# EAGLE design Single-Phase-Energy-Meter_v1.3-rev2 (EAGLE 9.3.0)
CNAME: Single Phase Energy Meter; CREVISION: 2; DESIGNER: John deGlavina
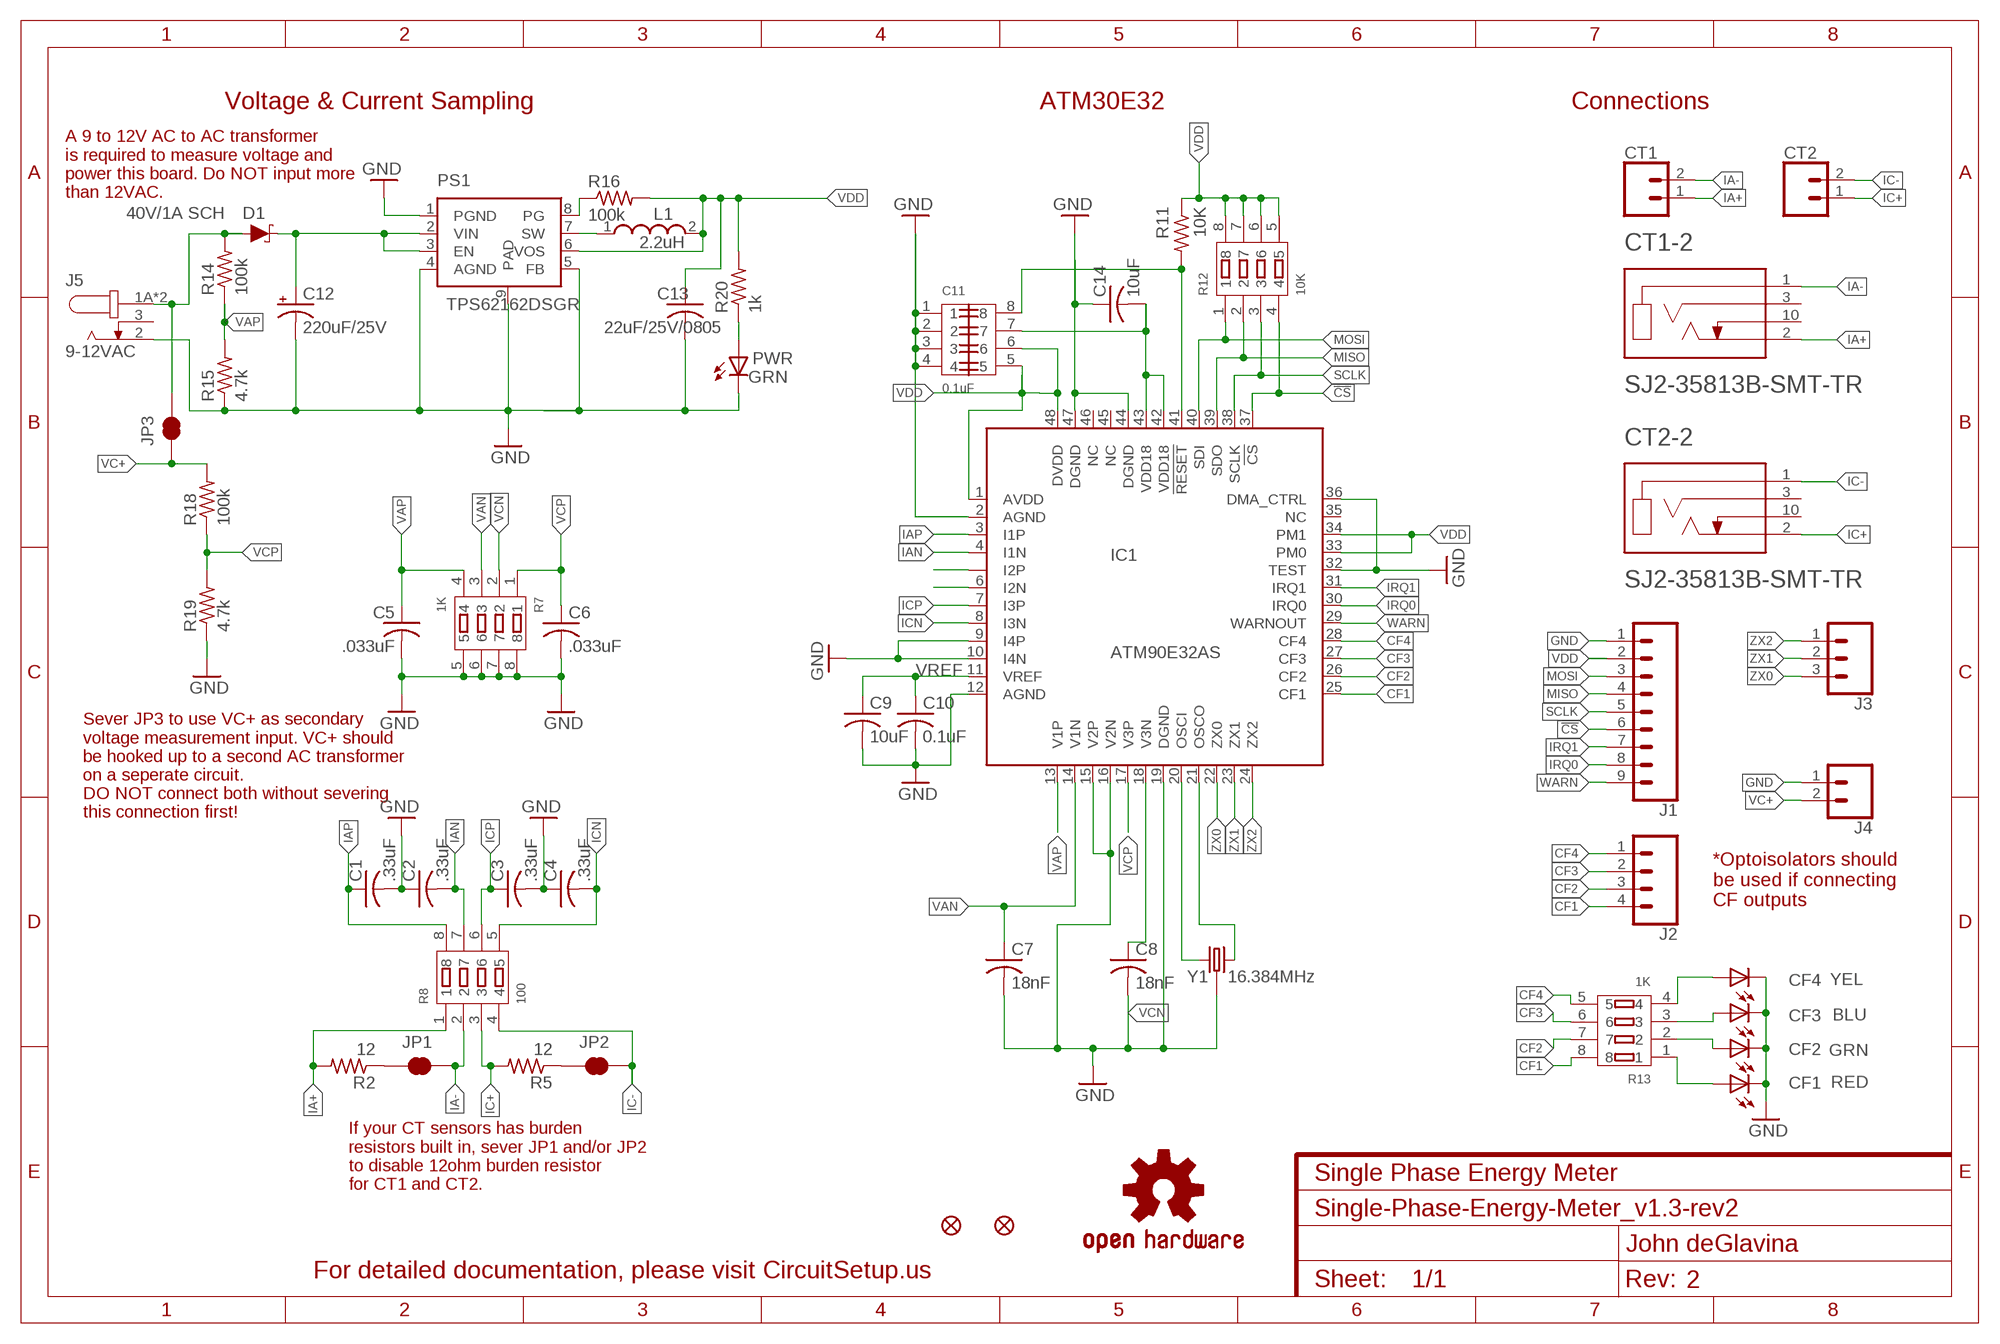
[diagram p0: schematic, sheet 1]

## Parts
C1  .33uF  C-USC0603  [C0603]
C2  .33uF  C-USC0603  [C0603]
C3  .33uF  C-USC0603  [C0603]
C4  .33uF  C-USC0603  [C0603]
C5  .033uF  C-USC0603  [C0603]
C6  .033uF  C-USC0603  [C0603]
C7  18nF  C-USC0603  [C0603]
C8  18nF  C-USC0603  [C0603]
C9  10uF  C-USC0603  [C0603]
C10  0.1uF  C-USC0603  [C0603]
C11  0.1uF  CAP-ARRAY4  [CAPCAF80P320X160X70-8]
C12  220uF/25V  CPOL-US153CLV-0605  [153CLV-0605]
C13  22uF/25V/0805  C-USC0805  [C0805]
C14  10uF  C-USC0603  [C0603]
CF1  RED  LEDCHIP-LED0603  [CHIP-LED0603]
CF2  GRN  LEDCHIP-LED0603  [CHIP-LED0603]
CF3  BLU  LEDCHIP-LED0603  [CHIP-LED0603]
CF4  YEL  LEDCHIP-LED0603  [CHIP-LED0603]
CT1  CONN_023.5MM  [SCREWTERMINAL-3.5MM-2]
CT1-2  SJ2-35813B-SMT-TR  [CUI_SJ2-35813B-SMT-TR]
CT2  CONN_023.5MM  [SCREWTERMINAL-3.5MM-2]
CT2-2  SJ2-35813B-SMT-TR  [CUI_SJ2-35813B-SMT-TR]
D1  40V/1A SCH  DIODE-SCHOTTKY-SS14  [SMA-DIODE]
FD1  FIDUCIALUFIDUCIAL  [FIDUCIAL-MICRO]
FD2  FIDUCIALUFIDUCIAL  [FIDUCIAL-MICRO]
IC1  ATM90E32AS  ATM90E36  [QFP50P900X900X120-48N]
J1  CONN_09  [1X09]
J2  CONN_04  [1X04]
J3  CONN_03  [1X03]
J4  CONN_02  [1X02]
J5  9-12VAC  PJ-002AH-SMT-TR  [CUI_PJ-002AH-SMT-TR]
JP1  JUMPER-SMT_2_NC_TRACE_SILK  [SMT-JUMPER_2_NC_TRACE_SILK]
JP2  JUMPER-SMT_2_NC_TRACE_SILK  [SMT-JUMPER_2_NC_TRACE_SILK]
JP3  JUMPER-SMT_2_NC_TRACE_SILK  [SMT-JUMPER_2_NC_TRACE_SILK]
L1  2.2uH  PA4332.222NLT  [INDPM4042X200N]
LOGO1  OSHW-LOGOS  [OSHW-LOGO-S]
PS1  TPS62162DSGR  [SON50P200X200X80-9N]
PWR  GRN  LEDCHIP-LED0603  [CHIP-LED0603]
R2  12  R-US_R0603  [R0603]
R5  12  R-US_R0603  [R0603]
R7  1K  SMD-RES-ARRAY-1K-4R(RA1206-8)  [RA1206-8]
R8  100  SMD-RES-ARRAY-1K-4R(RA1206-8)  [RA1206-8]
R11  10K  R-US_R0603  [R0603]
R12  10K  SMD-RES-ARRAY-1K-4R(RA1206-8)  [RA1206-8]
R13  1K  SMD-RES-ARRAY-1K-4R(RA1206-8)  [RA1206-8]
R14  100k  R-US_R0603  [R0603]
R15  4.7k  R-US_R0603  [R0603]
R16  100k  R-US_R0603  [R0603]
R18  100k  R-US_R0603  [R0603]
R19  4.7k  R-US_R0603  [R0603]
R20  1k  R-US_R0603  [R0603]
Y1  16.384MHz  CRYSTAL-GROUNDEDSMD-3.2X2.5  [CRYSTAL-SMD-3.2X2.5MM]

## Nets
!CS: IC1.37(!CS) J1.6 R12.4
!RESET: C11.8 IC1.41(!RESET) R11.2
CF1: IC1.25(CF1) J2.4 R13.8
CF2: IC1.26(CF2) J2.3 R13.7
CF3: IC1.27(CF3) J2.2 R13.6
CF4: IC1.28(CF4) J2.1 R13.5
GND: C1.2 C2.1 C3.2 C4.1 C5.2 C6.2 C7.2 C8.2 C9.2 C10.2 C11.1 C11.2 C11.3 C11.4 C12.- C13.2 C14.1 CF1.C CF2.C CF3.C CF4.C IC1.2(AGND) IC1.9(I4P) IC1.10(I4N) IC1.12(AGND) IC1.15(V2P) IC1.16(V2N) IC1.19(DGND) IC1.32(TEST) IC1.36(DMA_CTRL) IC1.44(DGND) IC1.47(DGND) J1.1 J4.1 J5.2 PS1.1(PGND) PS1.4(AGND) PS1.5(FB) PS1.9(PAD) PWR.C R7.5 R7.6 R7.7 R7.8 R15.1 R19.1 Y1.2 Y1.4
IA+ [analog]: CT1-2.2(TIP) CT1.1 R2.2 R8.1
IA- [analog]: CT1-2.1(SLEEVE) CT1.2 JP1.2 R8.2
IAN [analog]: C2.2 IC1.4(I1N) R8.7
IAP [analog]: C1.1 IC1.3(I1P) R8.8
IC+ [analog]: CT2-2.2(TIP) CT2.1 R5.2 R8.3
IC- [analog]: CT2-2.1(SLEEVE) CT2.2 JP2.2 R8.4
ICN [analog]: C4.2 IC1.8(I3N) R8.5
ICP [analog]: C3.1 IC1.7(I3P) R8.6
IRQ0: IC1.30(IRQ0) J1.8
IRQ1: IC1.31(IRQ1) J1.7
MISO: IC1.39(SDO) J1.4 R12.2
MOSI: IC1.40(SDI) J1.3 R12.1
N$1: JP1.1 R2.1
N$2: JP2.1 R5.1
N$3: CF4.A R13.4
N$4: CF3.A R13.3
N$5: CF2.A R13.2
N$6: CF1.A R13.1
N$7: L1.1 PS1.7(SW)
N$8: IC1.5(I2P)
N$9: PS1.8(PG) R16.1
N$10: IC1.6(I2N)
N$12: PWR.A R20.1
OSCI: IC1.20(OSCI) Y1.1
OSCO: IC1.21(OSCO) Y1.3
SCLK: IC1.38(SCLK) J1.5 R12.3
VA+: D1.A J5.1A J5.1B JP3.2 R14.2
VAN [analog]: C7.1 IC1.14(V1N) R7.3
VAP [analog]: C5.1 IC1.13(V1P) R7.4 R14.1 R15.2
VC+: J4.2 JP3.1 R18.2
VCN [analog]: C8.1 IC1.18(V3N) R7.2
VCP [analog]: C6.1 IC1.17(V3P) R7.1 R18.1 R19.2
VDD [pwr]: C11.5 C11.6 C13.1 IC1.1(AVDD) IC1.33(PM0) IC1.34(PM1) IC1.48(DVDD) J1.2 L1.2 PS1.6(VOS) R11.1 R12.5 R12.6 R12.7 R12.8 R16.2 R20.2
VDD18 [pwr]: C11.7 C14.2 IC1.42(VDD18) IC1.43(VDD18)
VIN1: C12.+ D1.C PS1.2(VIN) PS1.3(EN)
VREF: C9.1 C10.1 IC1.11(VREF)
WARN: IC1.29(WARNOUT) J1.9
ZX0: IC1.22(ZX0) J3.3
ZX1: IC1.23(ZX1) J3.2
ZX2: IC1.24(ZX2) J3.1
Unconnected: CT1-2.3(RING) CT1-2.10(TIP_SWITCH) CT2-2.3(RING) CT2-2.10(TIP_SWITCH) IC1.35(NC) IC1.45(NC) IC1.46(NC) J5.3

## Notes on the sheet
- Voltage & Current Sampling | ATM30E32 | Connections
- A 9 to 12V AC to AC transformer
  is required to measure voltage and 
  power this board. Do NOT input more 
  than 12VAC.
- Sever JP3 to use VC+ as secondary 
  voltage measurement input. VC+ should
  be hooked up to a second AC transformer
  on a seperate circuit.
  DO NOT connect both without severing 
  this connection first!
- *Optoisolators should 
  be used if connecting 
  CF outputs
- If your CT sensors has burden 
  resistors built in, sever JP1 and/or JP2
  to disable 12ohm burden resistor 
  for CT1 and CT2.
- For detailed documentation, please visit CircuitSetup.us

## Library data of the parts
C1-C10 C13 C14 = rcl:C-US: CAPACITOR, American symbol; SPICEPREFIX: C
C11 = CL31B104KACNBNC:CAP-ARRAY4
C12 = rcl:CPOL-US: POLARIZED CAPACITOR, American symbol; SPICEPREFIX: C
CF1-CF4 PWR = adafruit:LED: LED OSRAM: - CHIPLED LG R971, LG N971, LY N971, LG Q971, LY Q971, LO R971, LY R971 LH N974, LH R974 LS Q976, LO Q976, LY Q976 LO Q996 - Hyper CHIPLED LW Q18S LB Q993, LB Q99A, LB R99A - SideLED LS A670, LO A670, LY A670, LG A670, LP A670 LB A673, LV A673, LT A673, LW A673 LH A674 LY A675 LS A676, LA A676, LO A676, LY A676, LW A676 LS A679, LY A679, LG A679 - Hyper Micro SIDELED® LS Y876, LA Y876, LO Y876, LY Y876 LT Y87S - SmartLED LW L88C, LW L88S LB L89C, LB L89S, LG L890 LS L89K, LO L89K, LY L89K LS L896, LA L896, LO L896, LY L896 - TOPLED LS T670, LO T670, LY T670, LG T670, LP T670 LSG T670, LSP T670, LSY T670, LOP T670, LYG T670 LG T671, LOG T671, LSG T671 LB T673, LV T673, LT T673, LW T673 LH T674 LS T676, LA T676, LO T676, LY T676, LB T676, LH T676, LSB T676, LW T676 LB T67C, LV T67C, LT T67C, LS T67K, LO T67K, LY T67K, LW E67C LS E67B, LA E67B, LO E67B, LY E67B, LB E67C, LV E67C, LT E67C LW T67C LS T679, LY T679, LG T679 LS T770, LO T770, LY T770, LG T770, LP T770 LB T773, LV T773, LT T773, LW T773 LH T774 LS E675, LA E675, LY E675, LS T675 LS T776, LA T776, LO T776, LY T776, LB T776 LHGB T686 LT T68C, LB T68C - Hyper Mini TOPLED® LB M676 - Mini TOPLED Santana® LG M470 LS M47K, LO M47K, LY M47K Source: http://www.osram.convergy.de/
CT1 CT2 = SparkFun-Connectors:CONN_02: Multi connection point. Often used as Generic Header-pin footprint for 0.1 inch spaced/style header connections On any of the 0.1 inch spaced packages, you can populate with these: Break Away Headers - Straight <https://www.sparkfun.com/products/116> (PRT-00116) Break Away Male Headers - Right Angle <https://www.sparkfun.com/products/553> (PRT-00553) Female Headers <https://www.sparkfun.com/products/115> (PRT-00115) Break Away Headers - Machine Pin <https://www.sparkfun.com/products/117> (PRT-00117) Break Away Female Headers - Swiss Machine Pin <https://www.sparkfun.com/products/743> (PRT-00743) For SCREWTERMINALS and SPRING TERMINALS visit here: Screw Terimnals on SparkFun.com <https://www.sparkfun.com/search/results?term=Screw+Terminals> (5mm/3.5mm/2.54mm spacing) This device is also useful as a general connection point to wire up your design to another part of your project. Our various solder wires solder well into these plated through hole pads. Hook-Up Wire - Assortment (Stranded, 22 AWG) <https://www.sparkfun.com/products/11375> (PRT-11375) Hook-Up Wire - Assortment (Solid Core, 22 AWG) <https://www.sparkfun.com/products/11367> (PRT-11367) View the entire wire category on our website here <https://www.sparkfun.com/categories/141> Special notes: Molex polarized connector foot print use with: PRT-08233 with associated crimp pins and housings. 2.54_SCREWTERM for use with PRT-10571. 3.5mm Screw Terminal footprints for PRT-08084 5mm Screw Terminal footprints for use with PRT-08432; PROD_ID: CONN-08399
CT1-2 CT2-2 = SJ2-35813B-SMT-TR:SJ2-35813B-SMT-TR: 3 conductors, 3.5mm, SMT Audio Jack w/ Tip Switch; MANUFACTURER: CUI; MPN: SJ2-35813B-SMT-TR; PART_REV: 1.01; STANDARD: Manufacturer recommendation
D1 = SparkFun-DiscreteSemi:DIODE-SCHOTTKY: Schottky diode A Schottky diode is a semiconductor diode which has a low forward voltage drop and a very fast switching action.; PROD_ID: DIO-08053; VALUE: 1A/40V/500mV
FD1 FD2 = SparkFun-Aesthetics:FIDUCIAL: Fiducial Alignment Points Point-of-reference for pick-and-place machines and other optical instruments.
IC1 = ATM90E36:ATM90E36: ATMEL Poly-phase energy metering; OC_FARNELL: unknown; OC_NEWARK: unknown; SPICEPREFIX: X
J1 = SparkFun-Connectors:CONN_09: Multi connection point. Often used as Generic Header-pin footprint for 0.1 inch spaced/style header connections On any of the 0.1 inch spaced packages, you can populate with these: Break Away Headers - Straight <https://www.sparkfun.com/products/116> (PRT-00116) Break Away Male Headers - Right Angle <https://www.sparkfun.com/products/553> (PRT-00553) Female Headers <https://www.sparkfun.com/products/115> (PRT-00115) Break Away Headers - Machine Pin <https://www.sparkfun.com/products/117> (PRT-00117) Break Away Female Headers - Swiss Machine Pin <https://www.sparkfun.com/products/743> (PRT-00743) For SCREWTERMINALS and SPRING TERMINALS visit here: Screw Terimnals on SparkFun.com <https://www.sparkfun.com/search/results?term=Screw+Terminals> (5mm/3.5mm/2.54mm spacing) This device is also useful as a general connection point to wire up your design to another part of your project. Our various solder wires solder well into these plated through hole pads. Hook-Up Wire - Assortment (Stranded, 22 AWG) <https://www.sparkfun.com/products/11375> (PRT-11375) Hook-Up Wire - Assortment (Solid Core, 22 AWG) <https://www.sparkfun.com/products/11367> (PRT-11367) View the entire wire category on our website here <https://www.sparkfun.com/categories/141> Special notes: Molex polarized connector foot print use with SKU : PRT-08231 with associated crimp pins and housings. 1MM SMD Version SKU: PRT-10208 NOTES ON THE VARIANTS LOCK and LOCK_LONGPADS... This footprint was designed to help hold the alignment of a through-hole component (i.e. 6-pin header) while soldering it into place. You may notice that each hole has been shifted either up or down by 0.005 of an inch from it's more standard position (which is a perfectly straight line). This slight alteration caused the pins (the squares in the middle) to touch the edges of the holes. Because they are alternating, it causes a "brace" to hold the component in place. 0.005 has proven to be the perfect amount of "off-center" position when using our standard breakaway headers. Although looks a little odd when you look at the bare footprint, once you have a header in there, the alteration is very hard to notice. Also,if you push a header all the way into place, it is covered up entirely on the bottom side.
J2 = SparkFun-Connectors:CONN_04: Multi connection point. Often used as Generic Header-pin footprint for 0.1 inch spaced/style header connections On any of the 0.1 inch spaced packages, you can populate with these: Break Away Headers - Straight <https://www.sparkfun.com/products/116> (PRT-00116) Break Away Male Headers - Right Angle <https://www.sparkfun.com/products/553> (PRT-00553) Female Headers <https://www.sparkfun.com/products/115> (PRT-00115) Break Away Headers - Machine Pin <https://www.sparkfun.com/products/117> (PRT-00117) Break Away Female Headers - Swiss Machine Pin <https://www.sparkfun.com/products/743> (PRT-00743) For SCREWTERMINALS and SPRING TERMINALS visit here: Screw Terimnals on SparkFun.com <https://www.sparkfun.com/search/results?term=Screw+Terminals> (5mm/3.5mm/2.54mm spacing) This device is also useful as a general connection point to wire up your design to another part of your project. Our various solder wires solder well into these plated through hole pads. Hook-Up Wire - Assortment (Stranded, 22 AWG) <https://www.sparkfun.com/products/11375> (PRT-11375) Hook-Up Wire - Assortment (Solid Core, 22 AWG) <https://www.sparkfun.com/products/11367> (PRT-11367) View the entire wire category on our website here <https://www.sparkfun.com/categories/141> Special notes: Molex polarized connector foot print use with SKU : PRT-08231 with associated crimp pins and housings. 1MM SMD Version SKU: PRT-10208; PROD_ID: CONN-09696
J3 = SparkFun-Connectors:CONN_03: Multi connection point. Often used as Generic Header-pin footprint for 0.1 inch spaced/style header connections On any of the 0.1 inch spaced packages, you can populate with these: Break Away Headers - Straight <https://www.sparkfun.com/products/116> (PRT-00116) Break Away Male Headers - Right Angle <https://www.sparkfun.com/products/553> (PRT-00553) Female Headers <https://www.sparkfun.com/products/115> (PRT-00115) Break Away Headers - Machine Pin <https://www.sparkfun.com/products/117> (PRT-00117) Break Away Female Headers - Swiss Machine Pin <https://www.sparkfun.com/products/743> (PRT-00743) Stackable Header - 3 Pin (Female, 0.1") <https://www.sparkfun.com/products/13875> (PRT-13875) For SCREWTERMINALS and SPRING TERMINALS visit here: Screw Terimnals on SparkFun.com <https://www.sparkfun.com/search/results?term=Screw+Terminals> (5mm/3.5mm/2.54mm spacing) This device is also useful as a general connection point to wire up your design to another part of your project. Our various solder wires solder well into these plated through hole pads. Hook-Up Wire - Assortment (Stranded, 22 AWG) <https://www.sparkfun.com/products/11375> (PRT-11375) Hook-Up Wire - Assortment (Solid Core, 22 AWG) <https://www.sparkfun.com/products/11367> (PRT-11367) View the entire wire category on our website here <https://www.sparkfun.com/categories/141> Special notes: Molex polarized connector foot print use with SKU : PRT-08232 with associated crimp pins and housings.
J4 = SparkFun-Connectors:CONN_02: Multi connection point. Often used as Generic Header-pin footprint for 0.1 inch spaced/style header connections On any of the 0.1 inch spaced packages, you can populate with these: Break Away Headers - Straight <https://www.sparkfun.com/products/116> (PRT-00116) Break Away Male Headers - Right Angle <https://www.sparkfun.com/products/553> (PRT-00553) Female Headers <https://www.sparkfun.com/products/115> (PRT-00115) Break Away Headers - Machine Pin <https://www.sparkfun.com/products/117> (PRT-00117) Break Away Female Headers - Swiss Machine Pin <https://www.sparkfun.com/products/743> (PRT-00743) For SCREWTERMINALS and SPRING TERMINALS visit here: Screw Terimnals on SparkFun.com <https://www.sparkfun.com/search/results?term=Screw+Terminals> (5mm/3.5mm/2.54mm spacing) This device is also useful as a general connection point to wire up your design to another part of your project. Our various solder wires solder well into these plated through hole pads. Hook-Up Wire - Assortment (Stranded, 22 AWG) <https://www.sparkfun.com/products/11375> (PRT-11375) Hook-Up Wire - Assortment (Solid Core, 22 AWG) <https://www.sparkfun.com/products/11367> (PRT-11367) View the entire wire category on our website here <https://www.sparkfun.com/categories/141> Special notes: Molex polarized connector foot print use with: PRT-08233 with associated crimp pins and housings. 2.54_SCREWTERM for use with PRT-10571. 3.5mm Screw Terminal footprints for PRT-08084 5mm Screw Terminal footprints for use with PRT-08432
J5 = PJ-002AH-SMT-TR:PJ-002AH-SMT-TR: 2.0 mm Center Pin, 5.0 A, Right Angle, Surface Mount (SMT), Dc Power Jack Connector; AVAILABILITY: Good; DESCRIPTION: 24 VDC 5 A Surface Mount Unshielded 2 Conductors 3 Contacts Male Power Jack; MF: CUI; MP: PJ-002AH-SMT-TR; PACKAGE: None; PRICE: 0.88 USD
JP1-JP3 = SparkFun-Jumpers:JUMPER-SMT_2_NC_TRACE: Normally closed trace jumper This jumper has a trace between two pads so it's normally closed (NC). Use a razor knife to open the connection. For best results follow the IPC guidelines for cutting traces: Cutout at least 0.063 mm (0.005 in). Remove all loose material to clean up the cut area. Seal the cut with an approved epoxy. Reapply solder to reclose the connection.
L1 = PA4332.222NLT:PA4332.222NLT: Inductor Power Shielded Drum Core 2.2uH 20% 1MHz 4.3A 48mOhm DCR 1515 T/R Source: Datasheet <http://productfinder.pulseeng.com/products/datasheets/P761.pdf>; ARROW_PART_NUMBER: PA4332.222NLT; ARROW_PRICE-STOCK: https://www.arrow.com/en/products/pa4332.222nlt/pulse-electronics-corporation; DESCRIPTION: Inductor Power Shielded Drum Core 2.2uH 20% 1MHz 4.3A 48mOhm DCR 1515 T/R; HEIGHT: 2mm; MANUFACTURER_NAME: Pulse; MANUFACTURER_PART_NUMBER: PA4332.222NLT
LOGO1 = SparkFun-Aesthetics:OSHW-LOGO: Open-Source Hardware (OSHW) Logo This logo indicates the piece of hardware it is found on incorporates a OSHW license and/or adheres to the definition of open source hardware found here: http://freedomdefined.org/OSHW
PS1 = TPS62162DSGR:TPS62162DSGR: Voltage Regulators - Switching Regulators 3-17V 1A 3MHZ SD Converter Source: Datasheet <http://www.ti.com/lit/ds/symlink/tps62161.pdf>; ARROW_PART_NUMBER: TPS62162DSGR; ARROW_PRICE-STOCK: https://www.arrow.com/en/products/tps62162dsgr/texas-instruments; DESCRIPTION: Voltage Regulators - Switching Regulators 3-17V 1A 3MHZ SD Converter; HEIGHT: 0.8mm; MANUFACTURER_NAME: Texas Instruments; MANUFACTURER_PART_NUMBER: TPS62162DSGR
R2 R5 R11 R14-R16 R18-R20 = rcl:R-US_: RESISTOR, American symbol; SPICEPREFIX: R
R7 R13 = Seeed-Resistor-2016:SMD-RES-ARRAY-1K-4R(RA1206-8): 301030012; MPN: Chip-Array-Series-1%
R8 R12 = Seeed-Resistor-2016:SMD-RES-ARRAY-1K-4R(RA1206-8): 301030012; MPN: Chip-Array-Series-1%; VALUE: 1K
Y1 = SparkFun-Clocks:CRYSTAL-GROUNDED: Crystals w/ Ground Pin (Generic) These are passive quartz crystals, which can be used as a clock source for a microcontroller. Crystal's are usually two-terminal devices. A third terminal may be optionally connected to ground, as recommended by the manufaturer.

## Net classes
0 default: width 0.152 mm, drill 0.33 mm, clearance 0.152 mm
1 pwr: width 0.305 mm, drill 0.356 mm, clearance 0.152 mm
2 analog: width 0.305 mm, drill 0.33 mm, clearance 0.152 mm

## Board
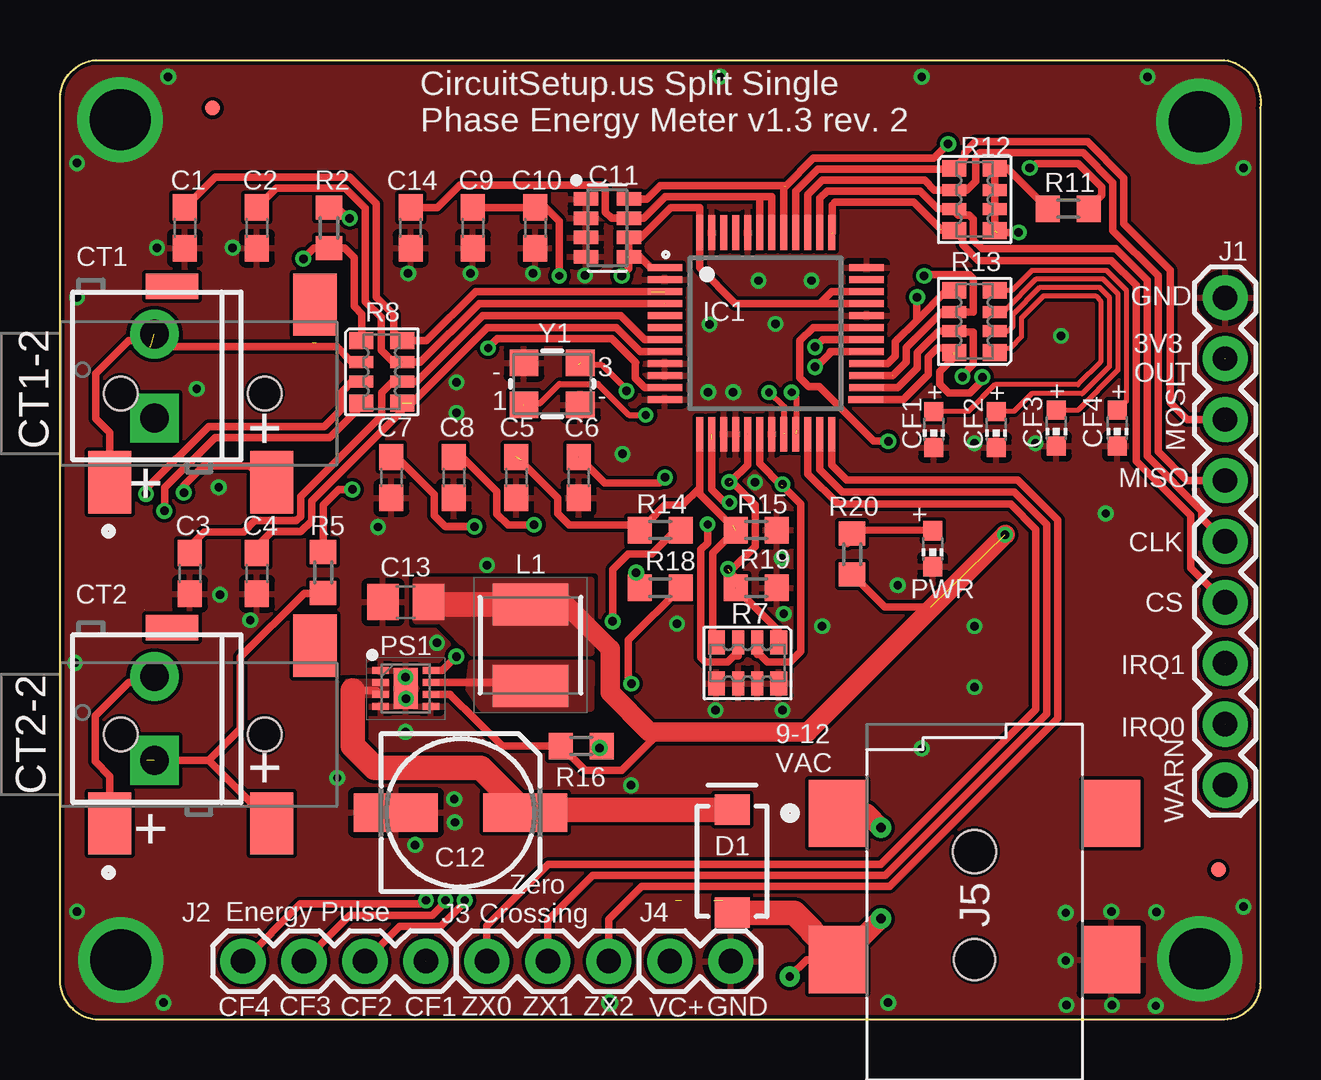
[diagram p1: board, top side]
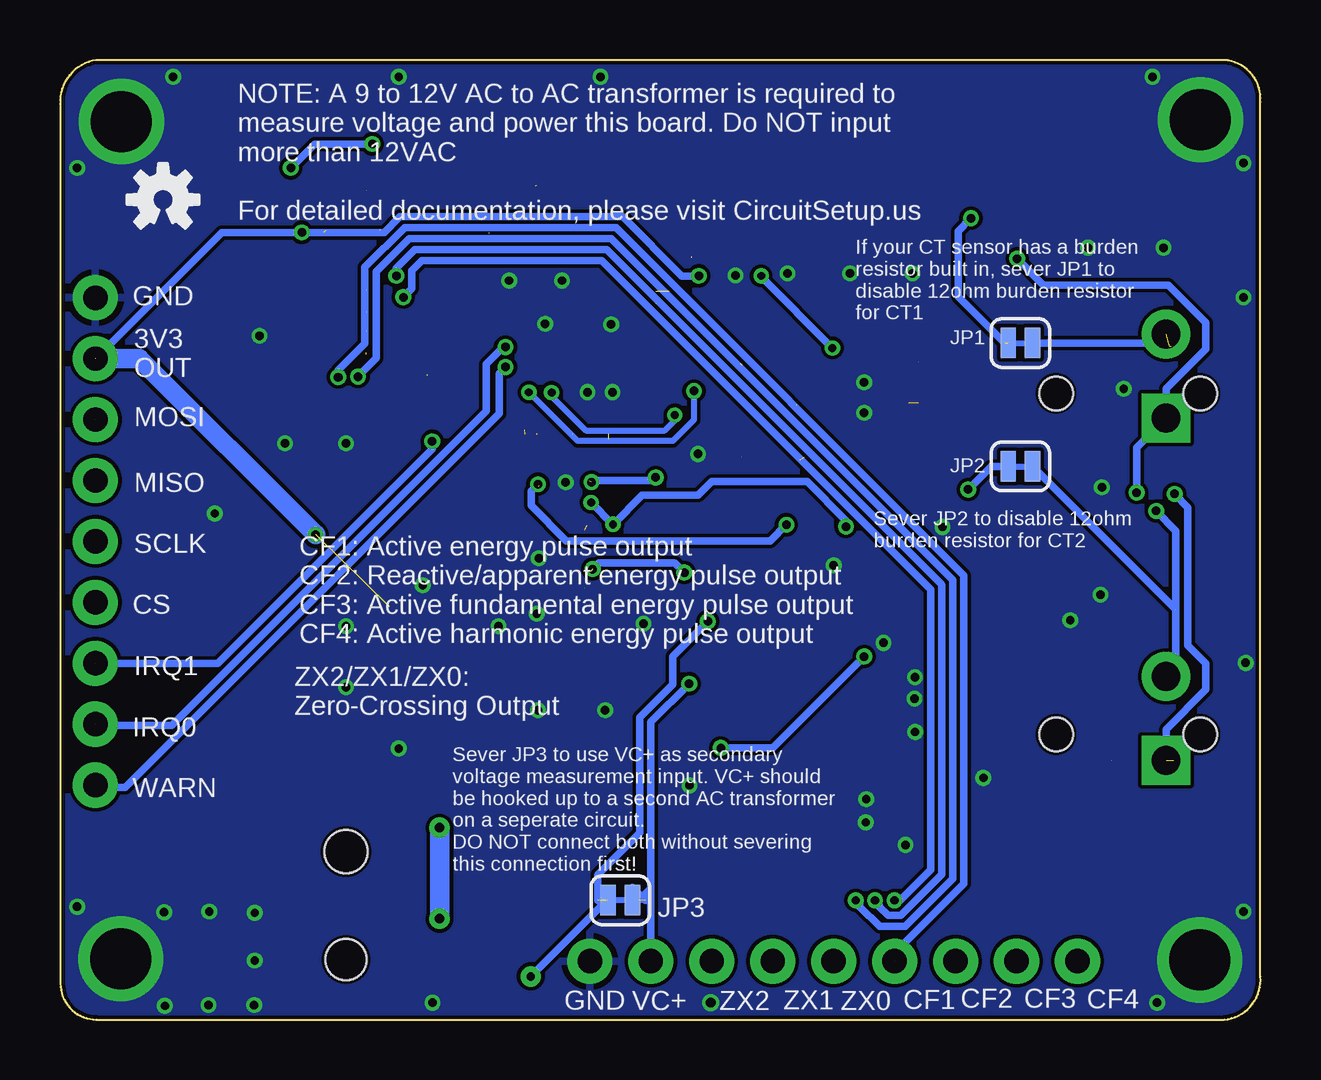
[diagram p2: board, bottom side, seen from below]

Size 50.02 x 40 mm. Coordinates in mm from the lower left corner, seen from the top.
Outline: 50.01,38 50.01,1.5 arc-90 48.51,0 1.51,0 arc-90 0.01,1.79 0.01,38.26 arc-90 1.51,40 48.51,40 arc-90 50.01,38
Copper layers (1*16): Top 0.035mm / dielectric 1.5mm / Bottom 0.035mm
Design rules "hackvana *": minimum track width 6mil, minimum drill 0.3mm, track to track 6mil, track to pad 6mil, pad to pad 6mil, via to via 6mil, smd to smd 0mil, copper to edge 6mil, drill to drill 6mil, minimum pad ring 10mil, minimum via ring 6mil, stop-mask expansion 4mil, vias tented up to drill 25mil, thermal gap 10mil

### Footprints (pad centres in the part's own frame; a part is rotated, then mirrored left to right if it is on the bottom)
C0603 = smd 1.1 x 1: 1 -0.85,0; 2 0.85,0
CAPCAF80P320X160X70-8 = smd 1.014 x 0.564: 1 -0.895,1.2; 2 -0.895,0.4; 3 -0.895,-0.4; 4 -0.895,-1.2; 5 0.895,-1.2; 6 0.895,-0.4; 7 0.895,0.4; 8 0.895,1.2
153CLV-0605 = smd 3.5 x 1.6: + 2.7,0; - -2.7,0
C0805 = smd 1.3 x 1.5: 1 -0.95,0; 2 0.95,0
CHIP-LED0603 = smd 0.8 x 0.8: A 0,-0.75; C 0,0.75
SCREWTERMINAL-3.5MM-2 = drill 1.2 pad 2.032 square: 1 0,0 | drill 1.2 pad 2.032: 2 3.5,0
CUI_SJ2-35813B-SMT-TR = smd 1.8 x 2.6: 1 -3.7,-3.7; 2 3.05,-3.7; 10 4.85,3.7 | smd 2.184 x 1.067: 3 -1.1,4.462 | hole 1.4: -3.25,0; 2.75,0
SMA-DIODE = smd 1.27 x 1.47: A -2.15,0; C 2.15,0
FIDUCIAL-MICRO = smd 0.635 x 0.635: 1 0,0
QFP50P900X900X120-48N = smd 1.45 x 0.3: 1 -4.2,2.75; 2 -4.2,2.25; 3 -4.2,1.75; 4 -4.2,1.25; 5 -4.2,0.75; 6 -4.2,0.25; 7 -4.2,-0.25; 8 -4.2,-0.75; 9 -4.2,-1.25; 10 -4.2,-1.75; 11 -4.2,-2.25; 12 -4.2,-2.75; 25 4.17,-2.75; 26 4.2,-2.25; 27 4.2,-1.75; 28 4.2,-1.25; 29 4.2,-0.75; 30 4.2,-0.25; 31 4.2,0.25; 32 4.2,0.75; 33 4.2,1.25; 34 4.2,1.75; 35 4.2,2.25; 36 4.2,2.75 | smd 0.3 x 1.45: 13 -2.75,-4.2; 14 -2.25,-4.2; 15 -1.75,-4.2; 16 -1.25,-4.2; 17 -0.75,-4.2; 18 -0.25,-4.2; 19 0.25,-4.2; 20 0.75,-4.2; 21 1.25,-4.2; 22 1.75,-4.2; 23 2.25,-4.2; 24 2.75,-4.2; 37 2.75,4.2; 38 2.25,4.2; 39 1.75,4.2; 40 1.25,4.2; 41 0.75,4.2; 42 0.25,4.2; 43 -0.25,4.2; 44 -0.75,4.2; 45 -1.25,4.2; 46 -1.75,4.2; 47 -2.25,4.2; 48 -2.75,4.2
1X09 = drill 1.016 pad 1.88: 1 0,0; 2 2.54,0; 3 5.08,0; 4 7.62,0; 5 10.16,0; 6 12.7,0; 7 15.24,0; 8 17.78,0; 9 20.32,0
1X04 = drill 1.016 pad 1.88: 1 0,0; 2 2.54,0; 3 5.08,0; 4 7.62,0
1X03 = drill 1.016 pad 1.88: 1 0,0; 2 2.54,0; 3 5.08,0
1X02 = drill 1.016 pad 1.88: 1 0,0; 2 2.54,0
CUI_PJ-002AH-SMT-TR = smd 2.8 x 2.4: 1A 0,0; 1B -6.1,0; 2 -6.1,-11.4; 3 0,-11.4 | hole 1.7: -6.1,-5.7 | hole 1.8: -1.6,-5.7
SMT-JUMPER_2_NC_TRACE_SILK = smd 0.635 x 1.27: 1 -0.508,0; 2 0.508,0
INDPM4042X200N = smd 1.75 x 3.15: 1 -1.7,0; 2 1.7,0
SON50P200X200X80-9N = smd 0.7 x 0.3: 1 -1.05,0.75; 2 -1.05,0.25; 3 -1.05,-0.25; 4 -1.05,-0.75; 5 1.05,-0.75; 6 1.05,-0.25; 7 1.05,0.25; 8 1.05,0.75 | smd 1 x 1.7: 9 0,0
R0603 = smd 1 x 1.1: 1 -0.85,0; 2 0.85,0
RA1206-8 = smd 0.7 x 1: 1 -1.3,-0.85; 4 1.3,-0.85; 5 1.3,0.85; 8 -1.3,0.85 | smd 0.5 x 1: 2 -0.4,-0.85; 3 0.4,-0.85; 6 0.4,0.85; 7 -0.4,0.85
CRYSTAL-SMD-3.2X2.5MM = smd 1.2 x 1.1: 1 -1.175,-0.875; 2 1.175,-0.875; 3 1.175,0.875; 4 -1.175,0.875

### Placement (x,y rotation side)
C1  5.21,33 270 top
C2  8.21,33 90 top
C3  5.41,18.6 270 top
C4  8.21,18.6 90 top
C5  19.01,22.6 270 top
C6  21.61,22.6 270 top
C7  13.81,22.6 270 top
C8  16.41,22.6 270 top
C9  17.21,33 270 top
C10  19.81,33 270 top
C11  22.81,33 0 top
C12  16.7,8.63 0 top
C13  14.41,17.4 180 top
C14  14.61,33 90 top
CF1  36.41,24.6 180 top
CF2  39.01,24.6 180 top
CF3  41.52,24.66 180 top
CF4  44.06,24.66 180 top
CT1  3.94,25.08 90 top
CT1-2  5.77,26.1 0 top
CT2  3.94,10.8 90 top
CT2-2  5.77,11.88 0 top
D1  28.01,6.6 90 top
FD1  6.36,37.99 0 top
FD2  48.27,6.24 0 top
IC1  29.41,28.6 0 top
J1  48.55,30.09 270 top
J2  7.63,2.43 0 top
J3  22.87,2.43 180 top
J4  27.95,2.43 180 top
J5  32.41,8.6 90 top
JP1  10.01,28.2 0 bottom
JP2  10.01,23.06 0 bottom
JP3  26.68,4.97 180 bottom
L1  19.61,15.6 90 top
LOGO1  45.73,34.18 0 bottom
PS1  14.41,13.8 0 top
PWR  36.36,19.63 180 top
R2  11.21,33 270 top
R5  10.97,18.64 270 top
R7  28.65,14.86 180 top
R8  13.41,27 270 top
R11  42.01,33.8 0 top
R12  38.11,34.18 270 top
R13  38.11,29.1 90 top
R14  25.01,20.4 0 top
R15  29.01,20.4 180 top
R16  21.72,11.4 180 top
R18  25.01,18 0 top
R19  29.01,18 180 top
R20  33.01,19.4 270 top
Y1  20.51,26.5 0 top

### Tracks (layer width: path | path; a pad name or v marks a point on that pad's centre or on a via)
!CS  (2 unrouted)
  Top 0.305: 36.7,32.94 35.57,34.08 32.29,34.08 32.17,33.95 IC1.37 | 36.7,32.91 37.23,32.91 R12.4 37.6,32.53 37.6,32.3 38.27,31.64 43.81,31.64 44.84,30.61 44.84,23.29 46.82,21.31 47.11,21.02 47.11,18.82 J1.6
!RESET  (via drill 0.36)  (1 unrouted)
  Top 0.305: IC1.41 30.16,34.76 29.47,34.76 29.01,34.76 25,34.76 24.44,34.2 C11.8 | 30.23,34.74 31.39,35.91 36.41,35.91 36.45,35.95 36.45,35.96 36.63,36.13 36.64,36.13 v37.01,36.5 | 43.01,33.96 R11.2 43.41,34.36 43.41,34.7 42.44,35.68 40.68,35.68 40.51,35.5 v40.41,35.5
  Bottom 0.305: v37.01,36.5 39.41,36.5 v40.41,35.5
CF1  (via drill 0.36)  (3 unrouted)
  Top 0.152: R13.8 37.26,27.62
  Top 0.305: 37.26,27.62 36.65,27.02 36.65,26.49 37.02,26.12 37.91,26.12 38.43,26.64 v38.43,26.78 | IC1.25 35.14,25.85 36.18,26.89 36.18,27.62 36.55,27.98 37.01,27.98 37.27,27.73
  Bottom 0.305: v38.43,26.78 38.43,27.07 37.32,28.18 37.32,31.36 35.67,33.01 26.85,33.01 12.36,18.52 12.36,5.67 15.24,2.78 J2.4
CF2  (via drill 0.35, 0.36)  (1 unrouted)
  Top 0.152: 37.33,28.66 R13.7
  Top 0.305: 37.33,28.66 38.06,28.66 38.06,27.32 37.61,26.87 v37.61,26.8 | IC1.26 34.91,26.35 35.72,27.16 35.72,27.8 36.62,28.7 R13.7 | J2.3 14.16,3.88 15.86,3.88 16.87,4.88 v16.87,4.97
  Bottom 0.305: v37.61,26.8 36.84,27.57 36.84,31.18 35.46,32.55 27.05,32.55 12.82,18.33 12.82,5.85 14.79,3.88 15.86,3.88 16.69,4.71 16.69,4.79 v16.87,4.97
CF3  (via drill 0.35, 0.36)  (2 unrouted)
  Top 0.152: 36.74,29.49 36.89,29.48 37.12,29.49 R13.6
  Top 0.305: 34.71,26.86 35.26,27.41 35.26,27.83 35.26,28.02 36.74,29.49 | v36.01,31 36.06,31.05 37.88,31.05 38.06,30.88 38.06,29.5 R13.6 | 34.7,26.85 IC1.27 | 16.06,4.92 v16.06,4.97 16.06,4.89 15.51,4.34 12.07,4.34 J2.2
  Bottom 0.305: v36.01,31 36.01,31.33 35.24,32.1 27.25,32.1 13.3,18.15 13.28,18.12 13.28,6.04 14.98,4.34 15.51,4.34 15.88,4.71 15.88,4.79 v16.06,4.97
CF4  (via drill 0.35, 0.36)  (1 unrouted)
  Top 0.152: R13.5 37.19,30.39 37.04,30.4 36.96,30.4
  Top 0.305: 35.69,29.14 34.81,28.25 34.81,27.66 34.5,27.35 IC1.28 | 35.69,29.14 36.96,30.4 | v35.72,30.11 35.69,30.09 35.69,29.14 | J2.1 10.01,4.82 15.09,4.82 v15.25,4.97
  Bottom 0.305: v35.72,30.11 35.36,30.47 35.36,31.23 34.95,31.64 33.81,31.64 27.44,31.64 13.73,17.94 13.73,6.24 | 13.73,6.24 13.73,6.23 | 13.73,6.24 15,4.97 v15.25,4.97
GND  (via drill 0.35, 0.4, 2.54)
  other vias: 16.52,25.29 30.11,12.9 28.95,22.4 35.91,11.3 40.65,24.02 25.71,16.5 27.01,26.15 21.88,31.02 38.11,13.86 13.25,20.53 29.11,30.8 31.31,30.8 29.81,29 7.93,16.65 7.19,32.17 4.05,32.17 14.51,31.1 17.11,31.1 19.71,31.1 43.8,4.5 45.68,4.47 34.91,18.1 30.16,16.92 27.31,12.9 16.52,26.56 23.44,23.58 38.11,24.02 28.05,26.15 31.76,16.4 41.91,4.45 41.91,2.46 27.06,28.98 43.83,0.6 41.93,0.6 22.91,0.7 4.31,0.7 0.71,4.5 0.71,30.1 0.71,35.7 4.51,39.3 27.51,39.3 35.91,39.3 45.31,39.3 49.31,35.5 45.66,0.57 49.31,4.7 0.62,14.87 14.4,14.27 14.42,13.38 14.39,11.99 15.71,15.7 34.51,0.7 16.45,8.22 14.8,7.28 11.55,10.07 16.43,9.18 41.71,28.5 2.51,37.51 47.46,37.43 2.53,2.48 47.49,2.53 5.7,26.3 6.61,22.18 6.66,17.71 17.79,18.94 43.57,21.09 23.79,9.76 38.11,16.4 30.07,19.22
  pour Top (rank 2): 0.01,40 50.01,40 50.01,0 0.01,0
  pour Bottom (rank 2): 0.01,40 50.01,40 50.01,0 0.01,0
IA+  (via drill 0.36)
  Top 0.305: v10.14,31.72 10.57,32.15 R2.2 11.87,32.15 12.26,31.76 12.26,29.73 12.58,29.41 12.58,28.32 R8.1 | v5.16,21.96 5.16,22.27 5.96,23.06 7.91,23.06 8.57,22.4 CT1-2.2
  Bottom 0.305: v5.16,21.96 5.16,23.85 CT1.1 3.94,26.3 2.29,27.95 2.29,29.05 3.85,30.61 9.05,30.61 9.05,30.62 v10.14,31.72
IA-  (2 unrouted)
  Top 0.305: CT1-2.1 2.07,24.47 1.49,25.05 1.49,26.93 2.87,28.31 3.45,28.31 3.71,28.05 | 3.78,28.05 11.53,28.05 12.18,27.39 R8.2
  Bottom 0.305: CT1.2 4.31,28.2 JP1.2
IAN  (2 unrouted)
  Top 0.305: IC1.4 17.46,29.85 15.02,27.4 R8.7 13.88,27.4 13.38,27.9 13.38,29.27 12.72,29.93 12.72,33.82 11.88,34.66 9.01,34.66 C2.2 8.21,33.63
IAP  (1 unrouted)
  Top 0.305: 24.64,30.35 23.37,30.35 17.32,30.35 15.27,28.3 R8.8 13.91,28.65 13.91,29.39 13.18,30.12 13.18,34.01 12.07,35.11 6.47,35.11 C1.1
IC+  (via drill 0.36)  (2 unrouted)
  Top 0.305: 6.2,10.8 CT2-2.2 8.85,8.2 | 6.2,10.8 3.61,10.8 | v3.58,21.91 3.58,22.11 6.2,24.73 11,24.73 11.75,25.48 11.75,26.18 12.18,26.61 R8.3 | R5.2 10.94,17.77 10.18,17.77 7.52,15.11 7.52,12.12 6.2,10.8
  Bottom 0.305: CT2.1 3.94,12.1 2.29,13.75 2.29,14.85 3.02,15.58 3.02,21.35 v3.58,21.91
IC-  (via drill 0.36)  (1 unrouted)
  Top 0.305: R8.4 12.61,25.65 12.61,25.63 11.24,24.27 6.46,24.27 4.37,22.18 4.37,21.22 v4.35,21.2 | CT2-2.1 2.07,10.15 1.47,10.75 1.47,12.65 2.87,14.05 3.94,14.05 CT2.2
  Bottom 0.305: JP2.2 3.52,17.09 | CT2.2 3.52,14.71 3.52,17.09 | v4.35,21.2 3.52,20.38 3.52,17.09
ICN  (1 unrouted)
  Top 0.305: 14.66,25.7 17.8,28.84 23.18,28.84 24.17,27.85 IC1.8 | 14.26,25.65 R8.5 14.22,25.67 14.22,25.35 10.48,21.61 10.48,20.79 10.04,20.34 8.82,20.34 8.33,19.84 8.33,19.45 C4.2
ICP
  Top 0.305: IC1.7 24.37,28.35 23.37,29.35 17.61,29.35 14.86,26.6 R8.6 14.24,26.58 13.86,26.58 13.41,26.14 13.41,25.18 10.03,21.8 10.03,20.98 9.85,20.8 8.12,20.8 7.65,20.32 6.01,20.32 5.41,19.72 C3.1
IRQ0  (via drill 0.36)  (1 unrouted)
  Top 0.305: IC1.30 31.77,28.35 v31.46,28.04
  Bottom 0.305: v31.46,28.04 31.55,28.04 32.27,27.32 32.27,25.36 45.37,12.26 48.5,12.26 J1.8
IRQ1  (via drill 0.36)  (1 unrouted)
  Top 0.305: IC1.31 31.38,28.85 30.82,28.3 30.82,26.76 31.2,26.38 31.63,26.38 33.9,24.11 v34.51,24.11
  Bottom 0.305: v34.51,24.11 34.51,23.78 43.45,14.84 J1.7
MISO  (1 unrouted)
  Top 0.152: 36.9,34.58 37.04,34.58 37.12,34.59 R12.2
  Top 0.305: R12.2 37.78,34.58 38.15,34.96 38.15,35.96 38.33,36.13 42.63,36.13 43.87,34.89 43.87,32.89 45.75,31.01 45.75,24.02 45.75,23.68 45.75,23.67 46.95,22.47 J1.4 | 36.9,34.58 36.44,34.58 36.02,34.99 31.77,34.99 31.16,34.38 IC1.39
MOSI  (1 unrouted)
  Top 0.305: IC1.40 30.66,34.52 31.58,35.45 37.23,35.45 R12.1 37.69,35.92 37.69,36.15 38.14,36.59 42.82,36.59 44.33,35.08 44.33,33.18 46.26,31.25 46.26,29.8 46.26,27.83 46.26,27.18 46.26,25.72 46.97,25.01 J1.3
N$1  (via drill 0.36)  (1 unrouted)
  Top 0.305: R2.1 11.56,33.85 12,33.4 v12.07,33.4
  Bottom 0.305: 10.67,28.2 12.6,30.13 12.6,32.87 v12.07,33.4
N$2  (via drill 0.36)
  Top 0.305: v12.18,22.1 11.62,22.1 10.97,21.44 10.97,19.76 11.22,19.51 11.2,19.49 R5.1
  Bottom 0.305: JP2.1 11.22,23.06 v12.18,22.1
N$3
  Top 0.203: CF4.A 44.43,25.78 44.43,30.4 43.6,31.23 40.5,31.23 39.67,30.4 R13.4
N$4
  Top 0.203: CF3.A 42.42,25.41 44.08,27.06 44.08,30.25 43.45,30.88 40.68,30.88 39.4,29.6 39.05,29.6 R13.3
N$5
  Top 0.203: CF2.A 39.74,25.35 40.48,26.09 42.59,26.09 43.72,27.22 43.72,30.11 43.3,30.52 40.83,30.52 39.71,29.4 39.71,28.9 39.51,28.7 R13.2
N$6
  Top 0.203: CF1.A 37.85,25.35 38.96,26.46 42.41,26.46 43.36,27.42 43.36,29.96 43.16,30.17 40.98,30.17 40.07,29.25 40.07,28.46 39.61,28 39.16,28 R13.1
N$7
  Top 0.305: PS1.7 19.46,14.05 L1.1
  pour Top (no thermals): 22.13,14.85 22.12,13 17.58,13 17.53,13.05 17.02,13.81 17.15,14.85
N$9  (via drill 0.36)
  Top 0.305: PS1.8 15.94,14.55 v16.52,15.13 | R16.1 v22.49,11.32
  Bottom 0.305: v16.52,15.13 20.33,11.32 v22.49,11.32
N$12
  Top 0.305: PWR.A 33.41,20.4 32.81,19.85 33.01,20.05 R20.1
OSCI  (via drill 0.33)  (2 unrouted)
  Top 0.152: 19.36,25.68 19.32,25.64 | 30.18,24.44 30.18,24.45
  Top 0.2: v29.54,26.14 29.54,26.19
  Top 0.254: 19.36,25.68 20,25.68 20.81,26.49 22.41,26.49 23.7,25.2 v24.41,25.2 | 29.54,26.19 30.18,25.55 30.18,24.45
  Bottom 0.2: v29.54,26.14 29.62,26.06
  Bottom 0.254: 29.62,26.06 28.12,24.56 24.82,24.56 24.41,24.97 v24.41,25.2
OSCO  (via drill 0.33, 0.36)  (2 unrouted)
  Top 0.2: v23.61,26.2 23.61,26.26
  Top 0.254: v30.48,26.15 30.67,25.96 30.67,24.56 | 23.61,26.26 22.59,27.28 21.6,27.28
  Bottom 0.254: v30.48,26.15 28.45,24.12 24.49,24.12 23.61,25 v23.61,26.2
SCLK
  Top 0.305: IC1.38 31.66,34.23 31.96,34.54 35.83,34.54 36.57,33.8 37.24,33.8 R12.3 37.25,33.72 37.43,33.54 37.88,33.54 38.06,33.36 38.06,32.49 38.43,32.12 43.99,32.12 45.29,30.82 45.29,23.48 47.57,21.21 47.57,20.91 J1.5
VA+  (via drill 0.35 pad 0.85, 0.36, 0.4 pad 0.85)  (1 unrouted)
  Top 0.305: v23.03,16.6 23.03,18.75 23.68,19.41 24.66,19.41 25.66,20.4 R14.2 | J5.1B 31.11,2.5 v30.41,1.8
  Top 0.813: J5.1A 33.61,8.6 v34.21,8 | v34.21,4.2 32.51,2.5 J5.1B
  Top 1.016: 32.51,2.5 31.32,3.69 31.32,3.72 30.59,4.45 D1.A
  Bottom 0.305: JP3.2 27.24,4.97 v30.41,1.8 | v23.03,16.6 24.49,15.14 24.49,13.96 25.86,12.59 25.86,7.79 27.62,6.04 27.62,4.97
  Bottom 0.813: v34.21,8 v34.21,4.2
VAN  (via drill 0.33, 0.35)  (1 unrouted)
  Top 0.305: 27.16,24.2 27.16,22.09 27.7,21.56 v27.9,21.56 | 28.23,15.69 R7.3 28.25,15.15 28.08,15.15 27.83,14.91 26.88,14.91 26.7,15.09 26.7,19.59 26.98,19.87 v26.98,20.64 | C7.1 14.03,23.45 15.6,21.88 15.6,21 16.06,20.55 v17.28,20.55
  Bottom 0.305: v17.28,20.55 17.28,20.8 18.89,22.42 22.86,22.42 23.43,21.86 25.76,21.86 v26.98,20.64 v27.9,21.55 v27.9,21.56
VAP  (2 unrouted)
  Top 0.305: 19.21,23.32 19.21,23.26 20.74,21.73 20.74,21.09 21.21,20.62 24.37,20.62 24.48,20.73 | IC1.13 26.66,22.17 | 28.05,20.59 27.98,20.59 26.66,21.91 26.66,22.17 | 26.66,22.17 25.93,21.44 25.2,21.44 24.48,20.73 | R15.2 27.19,19.44 27.19,15.53 27.35,15.38 R7.4 | 24.48,20.73 R14.1
VC+  (via drill 0.36)  (1 unrouted)
  Top 0.305: R18.2 23.69,15.83 23.69,14.12 v23.81,14
  Bottom 0.305: 25.41,5.48 25.91,4.97 JP3.1 | v23.81,14 25.41,12.4 25.41,4.97 | 25.41,4.97 25.64,4.97 26.17,5.5 | 25.41,4.97 J4.2
VCN  (via drill 0.35)  (2 unrouted)
  Top 0.305: IC1.18 29.16,23.17 30.06,22.27 | C8.1 16.76,23.45 18.2,22 18.2,21.07 18.67,20.61 19.73,20.61 v19.75,20.62 | v30.11,22.32 30.11,22.24 30.86,21.49 30.86,15.34 30.43,14.91 29.48,14.91 29.16,15.22 29.05,15.22 R7.2
  Bottom 0.305: v19.75,20.62 20.42,19.95 28.93,19.95 30.39,21.42 30.39,22.03 v30.11,22.32
VCP  (via drill 0.36)  (7 unrouted)
  Top 0.305: IC1.17 28.65,23.12 27.97,22.44 28.96,21.45 28.96,19.72 27.91,18.67 28.16,18.41 R19.2 29.93,16.23 29.93,15.73 R7.1 | C6.1 22.7,22.36 24.97,22.36 v25.21,22.6 | v24.01,18.63 24.01,18.15 R18.1
  Bottom 0.305: v25.21,22.6 25.33,22.48 27.8,22.48 v27.88,22.4 | v24.01,18.63 24.4,19.03 27.58,19.03 v27.83,18.78
VDD  (via drill 0.36)  (4 unrouted)
  Top 0.305: 39.03,32.81 v39.95,32.81 | R12.5 R12.6 R12.7 R12.8 39.48,35.48 R11.1 | 23.7,31.76 C11.6 24.21,32.6 25.45,33.84 26.66,33.84 IC1.48 26.66,31.34 28.14,29.85 31.66,29.85 | v23.41,31 23.7,31.3 C11.5 24.15,31.8 24.61,31.35 IC1.1 | IC1.34 32.16,30.35 31.66,29.85 | IC1.33 31.66,29.85 | PS1.6 16.26,13.55 16.26,13.52 18.43,11.4 R16.2 | 20.84,11.4 R16.2 | R20.2 34.37,17.19 36.28,17.19 | 25.02,11.99 23.41,10.38 21.89,10.38 R16.2
  Top 0.813: L1.2 21.07,17.3 22.92,15.45 22.92,13.63 24.56,11.99 25.02,11.99 31.16,11.99 v39.38,20.21
  Top 1.016: C13.1 15.46,17.3 L1.2
  Bottom 0.305: v23.41,31 24.11,31 26.58,33.47 35.86,33.47 36.52,32.81 v39.95,32.81 40.45,32.81 40.46,32.8 43.28,32.8 48.52,27.55 48.62,27.46
  Bottom 0.813: v39.38,20.21 46.72,27.55 48.52,27.55
  pour Top (no thermals): 14.84,18.3 22.1,18.3 22.1,15.31 17.18,15.31 15.86,16.63 14.84,16.63
VDD18
  Top 0.305: IC1.43 29.16,34.25 29.11,34.3 | 29.11,34.3 25.23,34.3 24.33,33.4 C11.7 22.99,33.4 22.72,33.66 22.72,34.61 22.55,34.79 16.66,34.79 15.73,33.85 C14.2 | IC1.42 29.66,34.3 29.11,34.3
VIN1
  Top 0.305: 12.19,13.73 13.18,13.73 PS1.3
  Top 1.016: D1.C 19.52,8.75 C12.+ 17.54,10.48 13.12,10.48 12.19,11.41 12.19,13.73
  pour Top (no thermals): 13.65,14.14 13.65,13.48 11.97,13.48 11.92,13.43 11.92,14.14
VREF  (via drill 0.33)
  Top 0.305: C9.1 C10.1 20.23,33.85 20.8,33.28 v20.8,31 v20.81,31 | v17.84,28 18.23,28.38 22.99,28.38 23.98,27.39 23.98,26.74 24.37,26.35 IC1.11
  Bottom 0.305: v20.81,31 20.81,30.96 v17.84,28
WARN  (via drill 0.36)
  Top 0.305: IC1.29 32.11,27.85 32.09,27.84 32.09,27.77 31.72,27.4 31.66,27.4 v31.46,27.2
  Bottom 0.305: v31.46,27.2 31.73,26.93 31.73,25.25 47.3,9.69 48.37,9.69 48.46,9.77 J1.9
ZX0
  Top 0.305: IC1.22 31.16,22.75 32.43,21.48 39.62,21.48 40.66,20.44 40.66,12.93 34.2,6.46 20.34,6.46 17.79,3.91 J3.3
ZX1
  Top 0.305: IC1.23 31.66,22.93 32.6,21.99 39.76,21.99 41.12,20.62 41.12,12.74 34.38,6.01 22.19,6.01 20.33,4.14 J3.2
ZX2
  Top 0.305: IC1.24 32.16,23.12 32.78,22.5 39.91,22.5 41.58,20.83 41.58,12.55 34.57,5.55 24.24,5.55 22.87,4.18 J3.1

### Text on the board
tPlace: - / 1 | 3 / - | + | + | + | + | + | + | + | + | 9-12 / VAC | + | Energy Pulse | Zero / Crossing | VC+
bPlace: If your CT sensor has a burden / resistor built in, sever JP1 to / disable 12ohm burden resistor / for CT1 | Sever JP2 to disable 12ohm / burden resistor for CT2 | Sever JP3 to use VC+ as secondary / voltage measurement input. VC+ should / be hooked up to a second AC transformer / on a seperate circuit. / DO NOT connect both without severing / this connection first! | VC+
tNames: CircuitSetup.us Split Single / Phase Energy Meter v1.3 rev. 2 | GND | 3V3 / OUT | MOSI | MISO | CLK | CS | IRQ1 | IRQ0 | WARN | CF4 | CF3 | CF2 | CF1 | ZX0 | ZX1 | ZX2 | GND
bNames: NOTE: A 9 to 12V AC to AC transformer is required to / measure voltage and power this board. Do NOT input / more than 12VAC / / For detailed documentation, please visit CircuitSetup.us | GND | 3V3 / OUT | MOSI | MISO | SCLK | CS | CF1: Active energy pulse output / CF2: Reactive/apparent energy pulse output / CF3: Active fundamental energy pulse output / CF4: Active harmonic energy pulse output | IRQ1 | ZX2/ZX1/ZX0: / Zero-Crossing Output | IRQ0 | WARN | CF4 | CF3 | CF2 | CF1 | ZX0 | ZX1 | ZX2 | GND